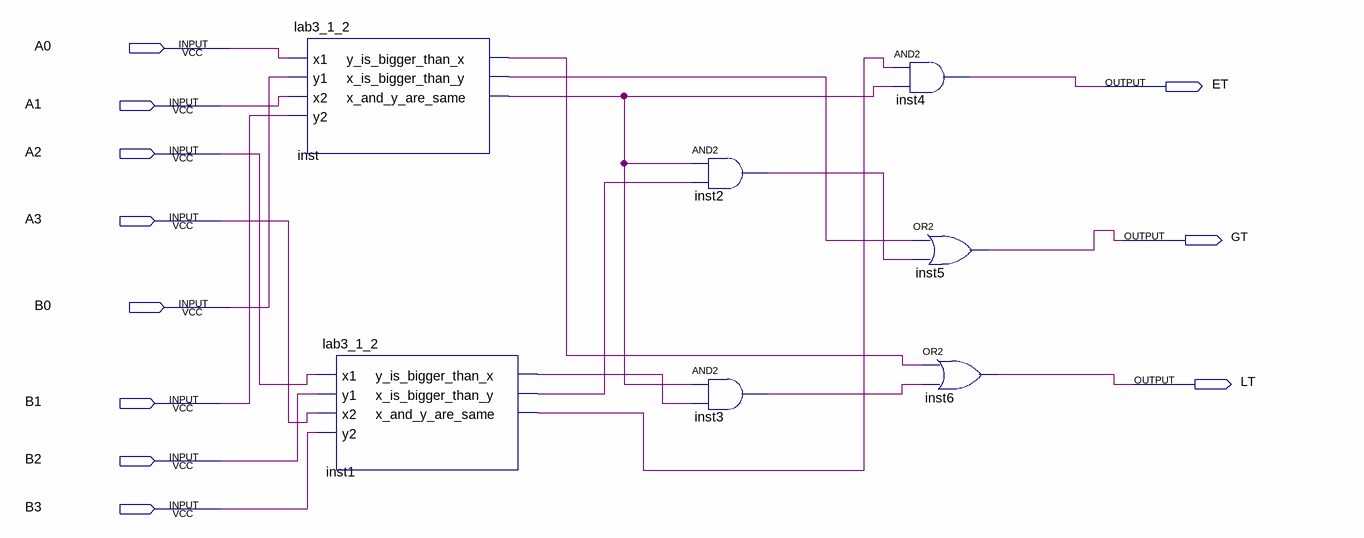
[diagram p0: schematic sheet]
// Quartus schematic hw3.bdf as structural Verilog: 7 symbols, 11 pins
module hw3 (
  input  A0,
  input  A1,
  input  A2,
  input  A3,
  input  B0,
  input  B1,
  input  B2,
  input  B3,
  output ET,
  output GT,
  output LT
);

  wire inst1_x_and_y_are_same, inst1_x_is_bigger_than_y, inst1_y_is_bigger_than_x, inst2_out, inst3_out,
       inst_x_and_y_are_same, inst_x_is_bigger_than_y, inst_y_is_bigger_than_x;

  lab3_1_2 inst (
    .x1(A0), .y1(B0), .x2(A1), .y2(B1), .y_is_bigger_than_x(inst_y_is_bigger_than_x),
    .x_is_bigger_than_y(inst_x_is_bigger_than_y), .x_and_y_are_same(inst_x_and_y_are_same));
  lab3_1_2 inst1 (
    .x1(A2), .y1(B2), .x2(A3), .y2(B3), .y_is_bigger_than_x(inst1_y_is_bigger_than_x),
    .x_is_bigger_than_y(inst1_x_is_bigger_than_y), .x_and_y_are_same(inst1_x_and_y_are_same));
  and inst2 (inst2_out, inst_x_and_y_are_same, inst1_x_is_bigger_than_y);
  and inst3 (inst3_out, inst_x_and_y_are_same, inst1_y_is_bigger_than_x);
  and inst4 (ET, inst1_x_and_y_are_same, inst_x_and_y_are_same);
  or inst5 (GT, inst_x_is_bigger_than_y, inst2_out);
  or inst6 (LT, inst_y_is_bigger_than_x, inst3_out);
endmodule
